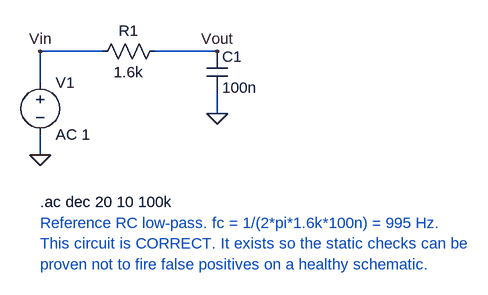
[diagram p0: schematic good_lowpass.asc]
good_lowpass.asc, the LTspice schematic file:
Version 4.1
SHEET 1 880 680
WIRE 0 -32 96 -32
WIRE 176 -32 272 -32
WIRE 0 16 0 -32
WIRE 0 128 0 96
WIRE 272 32 272 64
FLAG 0 128 0
FLAG 272 64 0
FLAG 0 -32 Vin
FLAG 272 -32 Vout
SYMBOL voltage 0 0 R0
WINDOW 123 24 124 Left 2
WINDOW 39 0 0 Left 0
SYMATTR InstName V1
SYMATTR Value AC 1
SYMBOL res 192 -48 R90
WINDOW 0 0 56 VBottom 2
WINDOW 3 32 56 VTop 2
SYMATTR InstName R1
SYMATTR Value 1.6k
SYMBOL cap 256 -32 R0
SYMATTR InstName C1
SYMATTR Value 100n
TEXT 0 200 Left 2 !.ac dec 20 10 100k
TEXT 0 232 Left 2 ;Reference RC low-pass. fc = 1/(2*pi*1.6k*100n) = 995 Hz.
TEXT 0 264 Left 2 ;This circuit is CORRECT. It exists so the static checks can be
TEXT 0 296 Left 2 ;proven not to fire false positives on a healthy schematic.

The netlist it stands for:
* good_lowpass.asc
V1 Vin 0 AC 1
R1 Vout Vin 1.6k
C1 Vout 0 100n
.ac dec 20 10 100k
* Reference RC low-pass. fc = 1/(2*pi*1.6k*100n) = 995 Hz.
* This circuit is CORRECT. It exists so the static checks can be
* proven not to fire false positives on a healthy schematic.
.backanno
.end